# Altium schematic sheet Sheet3.SchDoc
size A4
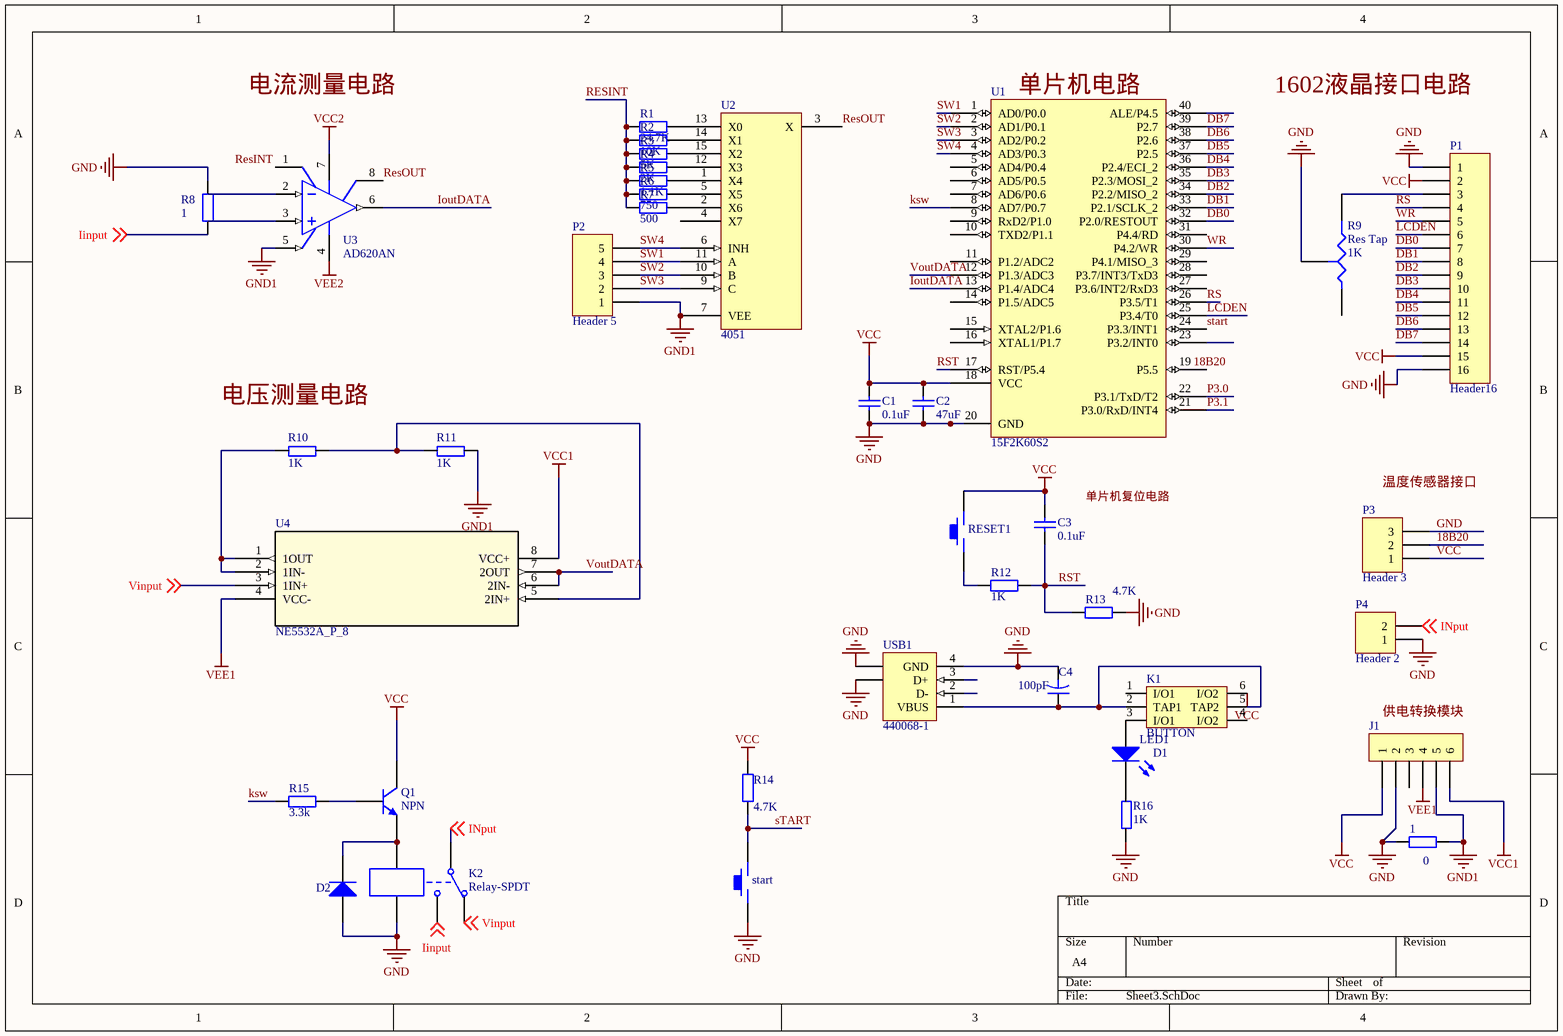
[diagram p0: Sheet3.SchDoc]

## Parts
1  value 0  [AXIAL-0.4]
C1  value 0.1uF  [RAD-0.3]  (hidden comment: Cap)
C2  value 47uF  [RAD-0.3]  (hidden comment: Cap)
C3  value 0.1uF  [RAD-0.3]  (hidden comment: Cap)
C4  value 100pF  [CAPR5-4X5]  (hidden comment: Cap2)
D1  LED1  [LED-1]
D2  Diode BAT18  [DIODE-0.4]  (value not drawn)
J1  CON6  [SIP6]  (value not drawn)
K1  BUTTON  [BTN8.5*8.5]
K2  Relay-SPDT  [PCBComponent_1]
P1  Header16
P2  Header 5  [HDR1X5]
P3  Header 3  [HDR1X3]
P4  Header 2  [HDR1X2]
Q1  NPN  [TO-226-AA]
R1  value 24.7K  [AXIAL-0.4]  (hidden comment: Res2)
R2  value 10K  [AXIAL-0.4]  (hidden comment: Res2)
R3  value 5K  [AXIAL-0.4]  (hidden comment: Res2)
R4  value 2K  [AXIAL-0.4]  (hidden comment: Res2)
R5  value 1.1K  [AXIAL-0.4]  (hidden comment: Res2)
R6  value 750  [AXIAL-0.4]  (hidden comment: Res2)
R7  value 500  [AXIAL-0.4]  (hidden comment: Res2)
R8  value 1  [AXIAL-0.4]  (hidden comment: Res2)
R9  Res Tap  value 1K  [VR3]
R10  1K  [AXIAL0.1Z]
R11  1K  [AXIAL0.1Z]
R12  value 1K  [0805]  (hidden comment: Res2)
R13  value 4.7K  [0805]  (hidden comment: Res2)
R14  value 4.7K  [0805]  (hidden comment: Res2)
R15  value 3.3k  [0805]  (hidden comment: Res2)
R16  1K  [0805]
RESET1  KEY_M  [KEY_M]  (value not drawn)
start  KEY_M  [KEY_M]  (value not drawn)
U1  15F2K60S2  [DIP40]
U2  4051  [DIP-16]
U3  AD620AN  [N-8]
U4  NE5532A_P_8  [DIP08]
USB1  440068-1  [440068]

## Nets
GND: 1.1 C1.1 C2.1 C4.2 D2.1(A) J1.2 K2.5 P1.1 P1.16 P3.3 P4.1 R8.2 R9.3(TAP) R13.1 R16.1 start.1 U1.20(GND) U2.8(GND) USB1.4(GND) USB1.5(SHLD) USB1.6(SHLD)
GND1: 1.2 J1.5 P2.1 R11.2 U2.7(VEE) U3.5(REF)
VCC: C1.2 C2.2 C3.2 J1.1 K1.6(I/O2) P1.2 P1.15 P3.1 Q1.1(C) R14.2 RESET1.2 U1.18(VCC) U2.16(VCC)
VCC1: J1.6 U4.8(VCC+)
VCC2: U3.7(V+)
VEE1: J1.4 U4.4(VCC-)
VEE2: U3.4(V-)
18B20: P3.2
DB0: P1.7 U1.32(P2.0/RESTOUT)
DB1: P1.8 U1.33(P2.1/SCLK_2)
DB2: P1.9 U1.34(P2.2/MISO_2)
DB3: P1.10 U1.35(P2.3/MOSI_2)
DB4: P1.11 U1.36(P2.4/ECI_2)
DB5: P1.12 U1.37(P2.5)
DB6: P1.13 U1.38(P2.6)
DB7: P1.14 U1.39(P2.7)
Iinput: K2.3 R8.1 ; off-sheet Iinput
INput: K2.1 P4.2 ; off-sheet INput
IoutDATA: U1.13(P1.4/ADC4) U3.6(OUT)
ksw: R15.2 U1.8(AD7/P0.7)
LCDEN: P1.6 U1.25(P3.4/T0)
P3.0: U1.22(P3.1/TxD/T2)
P3.1: U1.21(P3.0/RxD/INT4)
RESINT: R1.2 R2.2 R3.2 R4.2 R5.2 R6.2 R7.2
ResOUT: U2.3(X) U3.8(RG)
RS: P1.4 U1.26(P3.5/T1)
RST: C3.1 R12.2 R13.2 U1.17(RST/P5.4)
start: R14.1 start.2 U1.24(P3.3/INT1)
SW1: P2.4 U1.1(AD0/P0.0) U2.11(A)
SW2: P2.3 U1.2(AD1/P0.1) U2.10(B)
SW3: P2.2 U1.3(AD2/P0.2) U2.9(C)
SW4: P2.5 U1.4(AD3/P0.3) U2.6(INH)
Vinput: K2.2 U4.3(1IN+) ; off-sheet Vinput
VoutDATA: U1.12(P1.3/ADC3) U4.6(2IN-) U4.7(2OUT)
WR: P1.5 U1.30(P4.2/WR)
NetC4_1: C4.1 K1.2(TAP1) K1.5(TAP2) USB1.1(VBUS)
NetD1_1: D1.1(A) K1.3(I/O1)
NetD1_2: D1.2(K) R16.2
NetD2_3: D2.3(K) K2.4 Q1.3(E)
NetP1_3: P1.3 R9.2(B)
NetQ1_2: Q1.2(B) R15.1
NetR1_1: R1.1 U2.13(X0)
NetR2_1: R2.1 U2.14(X1)
NetR3_1: R3.1 U2.15(X2)
NetR4_1: R4.1 U2.12(X3)
NetR5_1: R5.1 U2.1(X4)
NetR6_1: R6.1 U2.5(X5)
NetR7_1: R7.1 U2.2(X6)
NetR10_1: R10.1 U4.1(1OUT) U4.2(1IN-)
NetR10_2: R10.2 R11.1 U4.5(2IN+)
NetR12_1: R12.1 RESET1.1

Not connected (* = marked no-connect by the designer): J1 3; K1 1(I/O1) 4(I/O2); R9 1(A); U1 5(AD4/P0.4) 6(AD5/P0.5) 7(AD6/P0.6) 9(RxD2/P1.0) 10(TXD2/P1.1) 11(P1.2/ADC2) 14(P1.5/ADC5) 15(XTAL2/P1.6) 16(XTAL1/P1.7) 19(P5.5) 23(P3.2/INT0) 27(P3.6/INT2/RxD3) 28(P3.7/INT3/TxD3) 29(P4.1/MISO_3) 31(P4.4/RD) 40(ALE/P4.5); U2 4(X7); U3 1(RG) 2(-IN) 3(+IN); USB1 2(D-) 3(D+)

## Notes on the sheet
- Labels drawn without touching a wire or pin: 18B20, 1602液晶接口电路, ResINT, 供电转换模块, 单片机复位电路, 单片机电路, 温度传感器接口, 电压测量电路, 电流测量电路

## Library data of the parts
1 R1-R8 R12-R15 = Res2: Resistor; Published: 8-Jun-2000; LatestRevisionDate: 17-Jul-2002; LatestRevisionNote: Re-released for DXP Platform.; PackageReference: AXIAL-0.4; Publisher: Altium Limited; PackageDescription: Axial Device, Thru-Hole; 2 Leads; 0.4 in Pin Spacing
C1-C3 = Cap: Capacitor; Published: 8-Jun-2000; LatestRevisionDate: 17-Jul-2002; LatestRevisionNote: Re-released for DXP Platform.; PackageReference: RAD-0.3; Publisher: Altium Limited; PackageDescription: Radial Cap, Thru-Hole; 2 Leads; 0.3 in Pin Spacing
C4 = Cap2: Capacitor; Published: 23-Sep-2002; PackageReference: CAPR5-4X5; Publisher: Altium Limited; PackageDescription: Capacitor; 2 Leads
D1 = LED1: Typical RED GaAs LED; Published: 8-Jun-2000; LatestRevisionDate: 08-Jul-2005; LatestRevisionNote: Mech Layer 1 removed.; PackageReference: LED-1; Publisher: Altium Limited; PackageDescription: LED; 2 Leads
D2 = Diode BAT18: Low-Loss RF Switching Diode; Note: Pin 2 is not connected and not drawn.; Published: 21-Mar-2003; PackageReference: SOT-23; Publisher: Altium Limited; ComponentLink1Description: Manufacturer Link; ComponentLink1URL: http://www.infineon.com/; LatestRevisionDate: 29-May-2009; LatestRevisionNote: IPC-7351 Footprint Added.; DatasheetVersion: Oct-1999; PackageVersion: Sep-2001; PackageDescription: 3-Pin SOT-23 Package 0.95 mm Pitch, 2.5 mm Lead Span
K2 = Relay-SPDT: Single-Pole Dual-Throw Relay; Published: 24-Mar-1999; LatestRevisionDate: 17-Jul-2002; LatestRevisionNote: Re-released for DXP Platform.; PackageReference: MODULE5B; Publisher: Altium Limited
P1 = CON16: Connector
P2 = Header 5: Header, 5-Pin; LatestRevisionDate: 17-Jul-2002; LatestRevisionNote: Re-released for DXP Platform.; Publisher: Altium Limited
P3 = Header 3: Header, 3-Pin; LatestRevisionDate: 17-Jul-2002; LatestRevisionNote: Re-released for DXP Platform.; Publisher: Altium Limited
P4 = Header 2: Header, 2-Pin; LatestRevisionDate: 17-Jul-2002; LatestRevisionNote: Re-released for DXP Platform.; Publisher: Altium Limited
Q1 = NPN: NPN Bipolar Transistor; Published: 8-Jun-2000; LatestRevisionDate: 17-Jul-2002; LatestRevisionNote: Re-released for DXP Platform.; PackageReference: TO-226-AA; Publisher: Altium Limited; PackageDescription: TO, Flat Index; 3 In-Line, Axial Leads; Body Dia. 4.8mm; Leads 0.55 x 0.51 mm (max); Code_JEDEC: TO-226-AA
R9 = Res Tap: Tapped Resistor; Sim Note: Enter the Resistance value and the set point into parameter fields.; Set Position: 0.5; Published: 24-Mar-1999; LatestRevisionDate: 17-Jul-2002; LatestRevisionNote: Re-released for DXP Platform.; PackageReference: VR3; Publisher: Altium Limited; PackageDescription: Variable Resistor, Thru-Hole; 3 Leads
R10 R11 R16 = R
U3 = AD620AN: Low-Cost, Low-Power Instrumentation Amplifier; Published: 8-Jun-2000; LatestRevisionDate: 04-Mar-2005; LatestRevisionNote: Stylized 3D Model Added.; DatasheetVersion: REV.D 1998; PackageVersion: revA; PackageReference: N-8; Publisher: Altium Limited; PackageDescription: DIP; 8 Leads; Row Spacing 7.62 mm; Pitch 2.54 mm; ComponentLink1Description: Manufacturer Link; ComponentLink1URL: http://www.analog.com/en/prod/0%2C2877%2CAD620%2C00.html; ComponentLink2Description: Datasheet; ComponentLink2URL: http://www.analog.com/UploadedFiles/Data_Sheets/897653854AD620_g.pdf
U4 = NE5532A_P_8: Imported; Manufacturer: Texas Instruments; INDUSTRY_STD_PKG_TYPE: PDIP; FAMILY_NAME: STANDARD LINEAR AMPLIFIER; PIN_COUNT: 8; PACKAGE_DESIGNATOR: P; Datasheet URL: http://www.ti.com/lit/gpn/NE5532A; GENERIC_PART_NUMBER: NE5532A; Vendor: Texas Instruments; Manufacturer_Part_Number: ne5532a_p_8; RefDes: RefDes; Type: Type; Value: Value
USB1 = 440068-1: USB 1.1, Right Angle, Thru-Hole, Reverse Type, Receptacle, 4 Position, Black; ContactMaterial: Copper Alloy; ContactPlating: Gold Flash; TerminationLength: 2.40mm [0.094in.]; PCB_Layout: Complies with manufacturer's recommendation.; DrillSize: Corresponds to nominal value.; PanelGround: Without; Published: 15-Jul-2004; DatasheetDocument: 18-Mar-2004; PackageDocument: 18-Mar-2004; PackageReference: 440068; Publisher: Altium Limited; HousingMaterial: Glass-Filled Thermoplastic; ComponentLink1Description: Manufacturer Link; ComponentLink1URL: http://www.tycoelectronics.com/; ComponentLink2Description: Packaging Specification; ComponentLink2URL: http://ecommas.tycoelectronics.com/commerce/DocumentDelivery/DDEController?Action=showdoc&DocId=Customer+Drawing%7F440068%7FD%7Ftif%7FEnglish%7FC_440068_D.tif